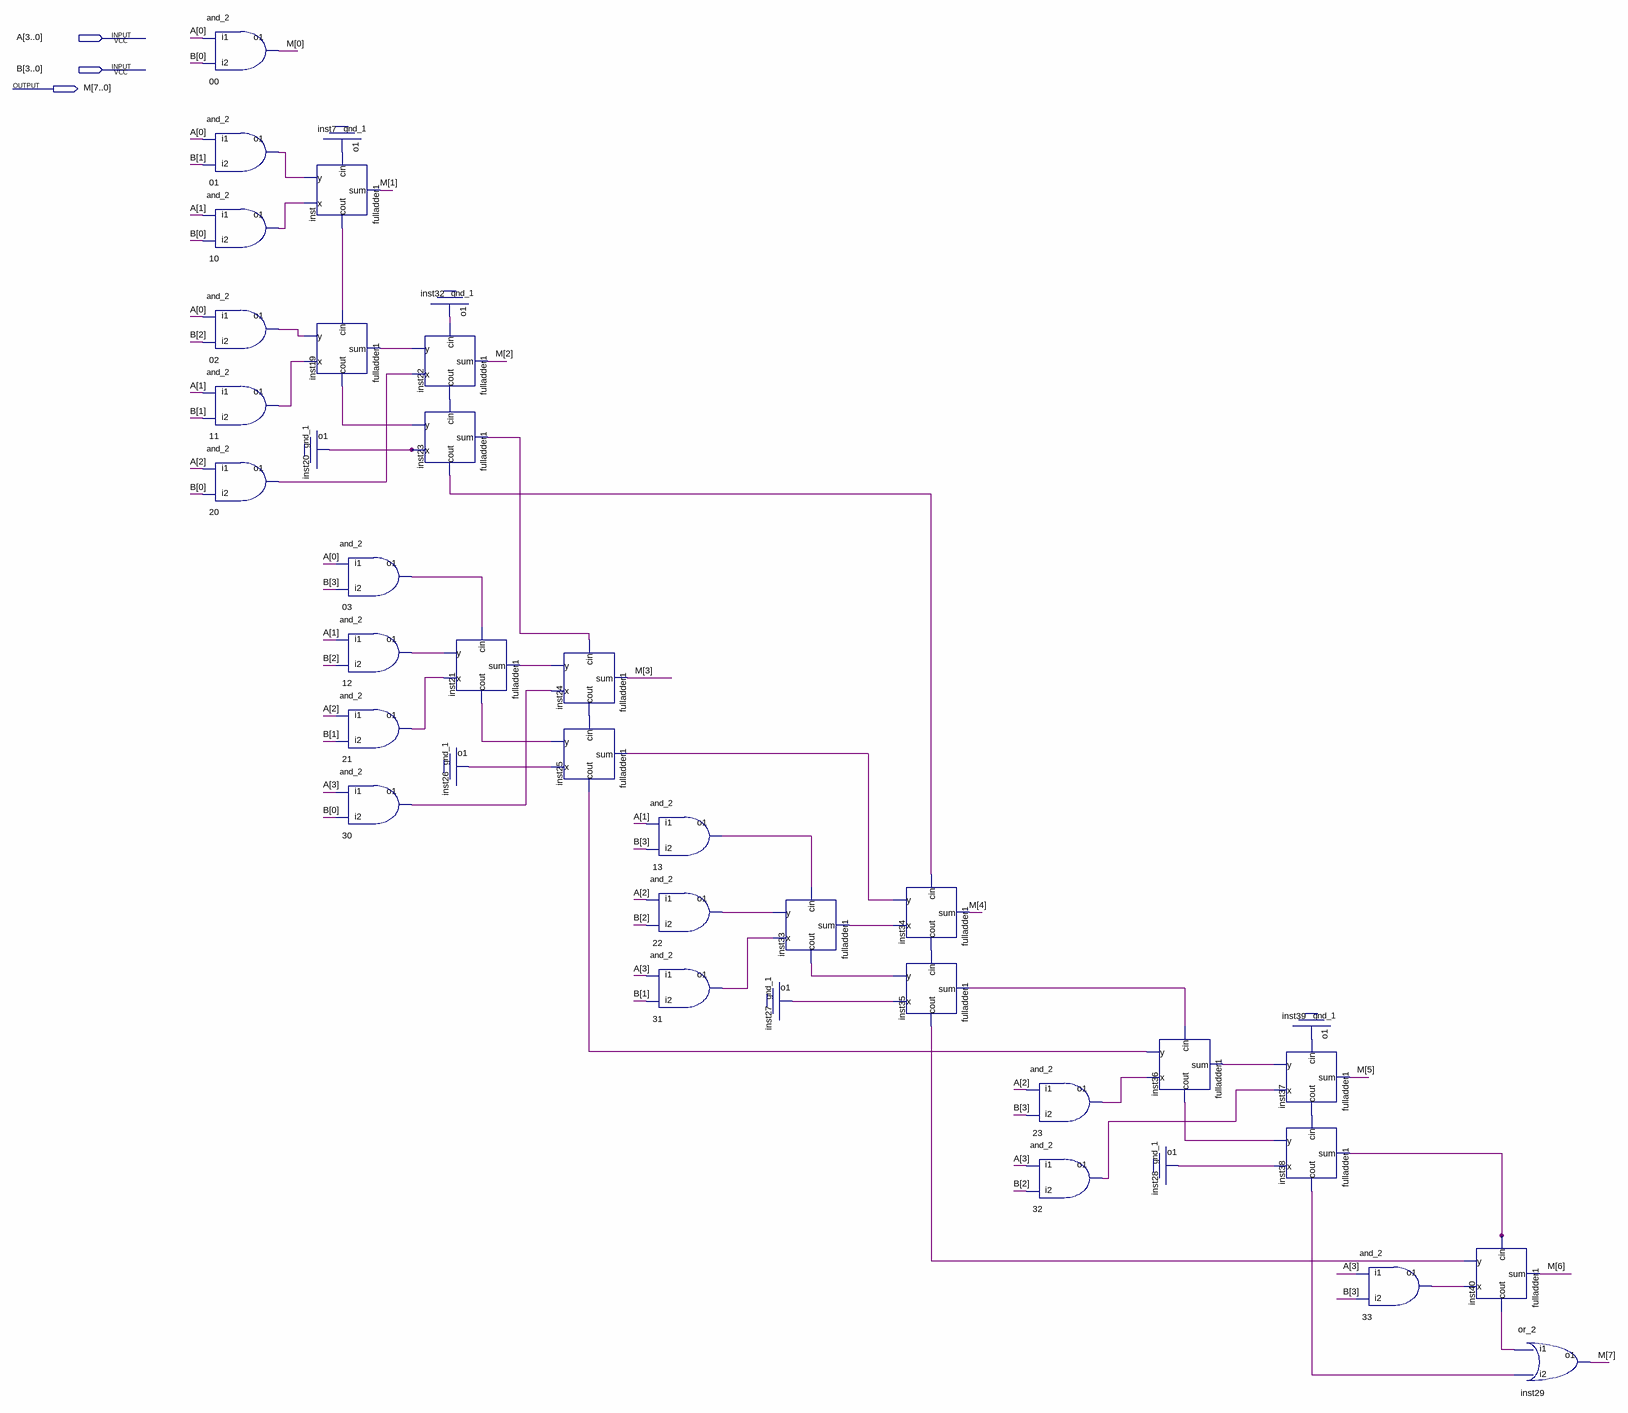
[diagram p0: schematic sheet]
// Quartus schematic MU4.bdf as structural Verilog: 38 symbols, 3 pins
module MU4 (
  input  [3:0] A,
  input  [3:0] B,
  output [7:0] M
);

  wire inst7_o1, inst19_cout, inst19_sum, inst20_o1, inst21_cout, inst21_sum, inst22_cout, inst23_cout,
       inst23_sum, inst24_cout, inst25_cout, inst25_sum, inst26_o1, inst27_o1, inst28_o1, inst32_o1,
       inst33_cout, inst33_sum, inst34_cout, inst35_cout, inst35_sum, inst36_cout, inst36_sum, inst37_cout,
       inst38_cout, inst38_sum, inst39_o1, inst40_cout, inst_cout, n01_o1, n02_o1, n03_o1, n10_o1, n11_o1,
       n12_o1, n13_o1, n20_o1, n21_o1, n22_o1, n23_o1, n30_o1, n31_o1, n32_o1, n33_o1;

  and_2 u_00 (.i1(A[0]), .i2(B[0]), .o1(M[0]));
  and_2 u_01 (.i1(A[0]), .i2(B[1]), .o1(n01_o1));
  and_2 u_10 (.i1(A[1]), .i2(B[0]), .o1(n10_o1));
  and_2 u_02 (.i1(A[0]), .i2(B[2]), .o1(n02_o1));
  and_2 u_11 (.i1(A[1]), .i2(B[1]), .o1(n11_o1));
  and_2 u_20 (.i1(A[2]), .i2(B[0]), .o1(n20_o1));
  gnd_1 inst7 (.o1(inst7_o1));
  fulladder1 inst (.x(n10_o1), .y(n01_o1), .cin(inst7_o1), .sum(M[1]), .cout(inst_cout));
  fulladder1 inst19 (.x(n11_o1), .y(n02_o1), .cin(inst_cout), .sum(inst19_sum), .cout(inst19_cout));
  gnd_1 inst20 (.o1(inst20_o1));
  and_2 u_03 (.i1(A[0]), .i2(B[3]), .o1(n03_o1));
  and_2 u_12 (.i1(A[1]), .i2(B[2]), .o1(n12_o1));
  and_2 u_21 (.i1(A[2]), .i2(B[1]), .o1(n21_o1));
  and_2 u_30 (.i1(A[3]), .i2(B[0]), .o1(n30_o1));
  gnd_1 inst32 (.o1(inst32_o1));
  fulladder1 inst22 (.x(n20_o1), .y(inst19_sum), .cin(inst32_o1), .sum(M[2]), .cout(inst22_cout));
  fulladder1 inst23 (.x(inst20_o1), .y(inst19_cout), .cin(inst22_cout), .sum(inst23_sum), .cout(inst23_cout));
  fulladder1 inst21 (.x(n21_o1), .y(n12_o1), .cin(n03_o1), .sum(inst21_sum), .cout(inst21_cout));
  gnd_1 inst26 (.o1(inst26_o1));
  fulladder1 inst24 (.x(n30_o1), .y(inst21_sum), .cin(inst23_sum), .sum(M[3]), .cout(inst24_cout));
  fulladder1 inst25 (.x(inst26_o1), .y(inst21_cout), .cin(inst24_cout), .sum(inst25_sum), .cout(inst25_cout));
  and_2 u_13 (.i1(A[1]), .i2(B[3]), .o1(n13_o1));
  and_2 u_22 (.i1(A[2]), .i2(B[2]), .o1(n22_o1));
  and_2 u_31 (.i1(A[3]), .i2(B[1]), .o1(n31_o1));
  fulladder1 inst33 (.x(n31_o1), .y(n22_o1), .cin(n13_o1), .sum(inst33_sum), .cout(inst33_cout));
  gnd_1 inst27 (.o1(inst27_o1));
  fulladder1 inst34 (.x(inst33_sum), .y(inst25_sum), .cin(inst23_cout), .sum(M[4]), .cout(inst34_cout));
  fulladder1 inst35 (.x(inst27_o1), .y(inst33_cout), .cin(inst34_cout), .sum(inst35_sum), .cout(inst35_cout));
  and_2 u_23 (.i1(A[2]), .i2(B[3]), .o1(n23_o1));
  and_2 u_32 (.i1(A[3]), .i2(B[2]), .o1(n32_o1));
  fulladder1 inst36 (.x(n23_o1), .y(inst25_cout), .cin(inst35_sum), .sum(inst36_sum), .cout(inst36_cout));
  gnd_1 inst28 (.o1(inst28_o1));
  gnd_1 inst39 (.o1(inst39_o1));
  fulladder1 inst37 (.x(n32_o1), .y(inst36_sum), .cin(inst39_o1), .sum(M[5]), .cout(inst37_cout));
  fulladder1 inst38 (.x(inst28_o1), .y(inst36_cout), .cin(inst37_cout), .sum(inst38_sum), .cout(inst38_cout));
  and_2 u_33 (.i1(A[3]), .i2(B[3]), .o1(n33_o1));
  fulladder1 inst40 (.x(n33_o1), .y(inst35_cout), .cin(inst38_sum), .sum(M[6]), .cout(inst40_cout));
  or_2 inst29 (.i1(inst40_cout), .i2(inst38_cout), .o1(M[7]));
endmodule
